# Altium project panel_board_PRJ.PrjPCB
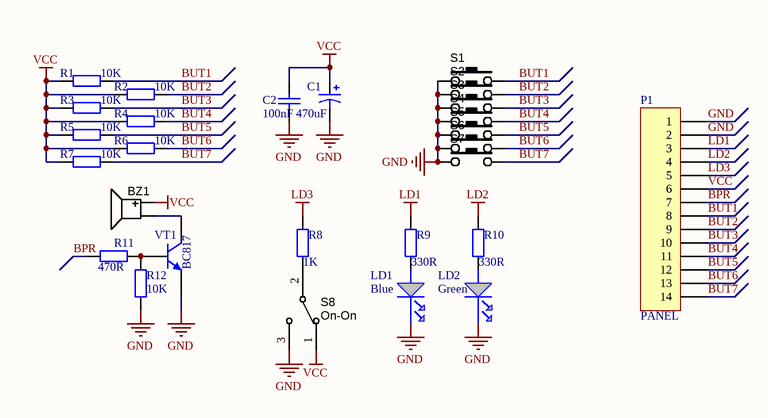
[diagram p0: panel_board_CHM.SchDoc]
1 sheet, 27 parts. Net scope: global (net labels, ports and power ports of the same name join across sheets).
Board file: panel_board_PCB.PcbDoc

## Sheet panel_board_CHM.SchDoc
size A4

### Parts
BZ1  Alternate part: 3100-932  [BUZZER_12.0X8.5MM]  (value not drawn)
C1  value 470uF  [CAPAE200P550X1200_FLAT1]  (hidden comment: Cap Pol1)
C2  value 100nF  [CAPC2012X135N]  (hidden comment: C0805)
LD1  value Blue  [LED-0603-BLUE]  (hidden comment: PWR_L)
LD2  value Green  [LED-0603-GREEN]  (hidden comment: PWR_H)
P1  PANEL  [14P_PCB_HEADER_BRD_MNT]
R1  value 10K  [RESC2012X70N]  (hidden comment: Res2)
R2  value 10K  [RESC2012X70N]  (hidden comment: Res2)
R3  value 10K  [RESC2012X70N]  (hidden comment: Res2)
R4  value 10K  [RESC2012X70N]  (hidden comment: Res2)
R5  value 10K  [RESC2012X70N]  (hidden comment: Res2)
R6  value 10K  [RESC2012X70N]  (hidden comment: Res2)
R7  value 10K  [RESC2012X70N]  (hidden comment: Res2)
R8  value 1K  [RESC2012X70N]  (hidden comment: Res2)
R9  value 330R  [RESC2012X70N]  (hidden comment: Res2)
R10  value 330R  [RESC2012X70N]  (hidden comment: Res2)
R11  value 470R  [RESC2012X70N]  (hidden comment: Res2)
R12  value 10K  [RESC2012X70N]  (hidden comment: Res2)
S1  SW_THT_PB_7.0mm  [TACT-SWITCH-TS1170]  (value not drawn)
S2  SW_THT_PB_7.0mm  [TACT-SWITCH-TS1170]  (value not drawn)
S3  SW_THT_PB_7.0mm  [TACT-SWITCH-TS1170]  (value not drawn)
S4  SW_THT_PB_7.0mm  [TACT-SWITCH-TS1170]  (value not drawn)
S5  SW_THT_PB_7.0mm  [TACT-SWITCH-TS1170]  (value not drawn)
S6  SW_THT_PB_7.0mm  [TACT-SWITCH-TS1170]  (value not drawn)
S7  SW_THT_PB_7.0mm  [TACT-SWITCH-TS1170]  (value not drawn)
S8  ON-ON  [SWITCH_SPDT_SLIDER]
VT1  BC817  [SOT23-3]

### Nets
GND: C1.2 C2.1 LD1.K(CATODE) LD2.K(CATODE) P1.1 P1.2 R12.1 S1.1 S2.1 S3.1 S4.1 S5.1 S6.1 S7.1 S8.3 VT1.3(E)
LD1: P1.3 R9.2
LD2: P1.4 R10.2
LD3: P1.5 R8.2
VCC: BZ1.1(Positive) C1.1 C2.2 P1.6 R1.1 R2.1 R3.1 R4.1 R5.1 R6.1 R7.1 S8.1
BPR: P1.7 R11.1
BUT1: P1.8 R1.2 S1.2
BUT2: P1.9 R2.2 S2.2
BUT3: P1.10 R3.2 S3.2
BUT4: P1.11 R4.2 S4.2
BUT5: P1.12 R5.2 S5.2
BUT6: P1.13 R6.2 S6.2
BUT7: P1.14 R7.2 S7.2
NetBZ1_2: BZ1.2(Negative) VT1.1(C)
NetLD1_A: LD1.A(ANODE) R9.1
NetLD2_A: LD2.A(ANODE) R10.1
NetR8_1: R8.1 S8.2
NetR11_2: R11.2 R12.2 VT1.2(B)

### Library data of the parts
BZ1 = BZ_12x8.5x6.5_2kHz: Speaker, Magnetic Transducer; Manufacturer 1: CUI Inc; Manufacturer Part Number 1: CEM-1201(50); Ratings: 2048 ±200 Hz; SCDType: source; Package / Case: 6.5mm pitch; Material: Noryl SE1-J; Supplier 1: Digi-Key; Supplier Part Number 1: 102-1152-ND
C1 = Cap Pol1: Polarized Capacitor (Radial); Published: 8-Jun-2000; LatestRevisionDate: 17-Jul-2002; LatestRevisionNote: Re-released for DXP Platform.; PackageReference: RB7.6-15; Publisher: Altium Limited; PackageDescription: Polarized Capacitor (Radial); 2 Leads
C2 = C0805: Ceramic Chip Capacitor - Standard; Note: Footprint corresponds to dimensions for bulk cassette packaging. This case size has tightened tolerances.; Published: 17-Jul-2002; LatestRevisionDate: 19-Mar-2004; LatestRevisionNote: Silkscreen size reduced.; DatasheetDocument: Mar-2001; PackageDocument: Mar-2001; PackageReference: 0805; Publisher: Altium Limited; Code_JEITA: 0805; Code_IPC: 2012[0805]; ComponentLink1Description: Manufacturer Link; ComponentLink1URL: http://www.kemet.com/; ComponentLink2Description: Datasheet; ComponentLink2URL: http://www.kemet.com/kemet/web/homepage/kechome.nsf/vapubfilesname/F3102TA.pdf/$file/F3102TA.pdf
LD1 LD2 = LED: APT1608QBC/D
P1 = Header 14: Header, 14-Pin; LatestRevisionDate: 17-Jul-2002; LatestRevisionNote: Re-released for DXP Platform.; Publisher: Altium Limited
R1-R12 = Res2: Resistor; Published: 8-Jun-2000; LatestRevisionDate: 17-Jul-2002; LatestRevisionNote: Re-released for DXP Platform.; PackageReference: AXIAL-0.4; Publisher: Altium Limited; PackageDescription: Axial Device, Thru-Hole; 2 Leads; 0.4 in Pin Spacing
S1-S7 = SW_THT_PB_7.0mm: Switch, tact, 7.0mm stem; Manufacturer 1: Bond-Tact; Manufacturer Part Number 1: TS-1170-WP-300; SCDType: source*; Function: On/Off; Package / Case: 6.5x6.5mm; 7.0mm stem; Material: Brass/Nylon/Ag plating
S8 = SW_THD_SPDT_On-On: Switch THD vertical toggle SPDT; Manufacturer 1: TE Connectivity; Manufacturer Part Number 1: SLS121PC04; Contact Rating @ Voltage: 0.25A @ 125VAC; SCDType: spec; Circuit: SPDT; Mounting Type: PCB mount; Supplier 1: Digi-Key; Supplier Part Number 1: 450-1598-ND; Switch Function: On-On
VT1 = QNPN: NPN Bipolar Transistor; pin to pad: 1>3 3>1; Published: 8-Jun-2000; LatestRevisionDate: 29-May-2009; LatestRevisionNote: IPC-7351 Footprint Added.; PackageVersion: Aug-1999; PackageReference: SOT-23B; Publisher: Altium Limited; PackageDescription: 3-Pin SOT-23 Package 0.95 mm Pitch, 2.4 mm Lead Span